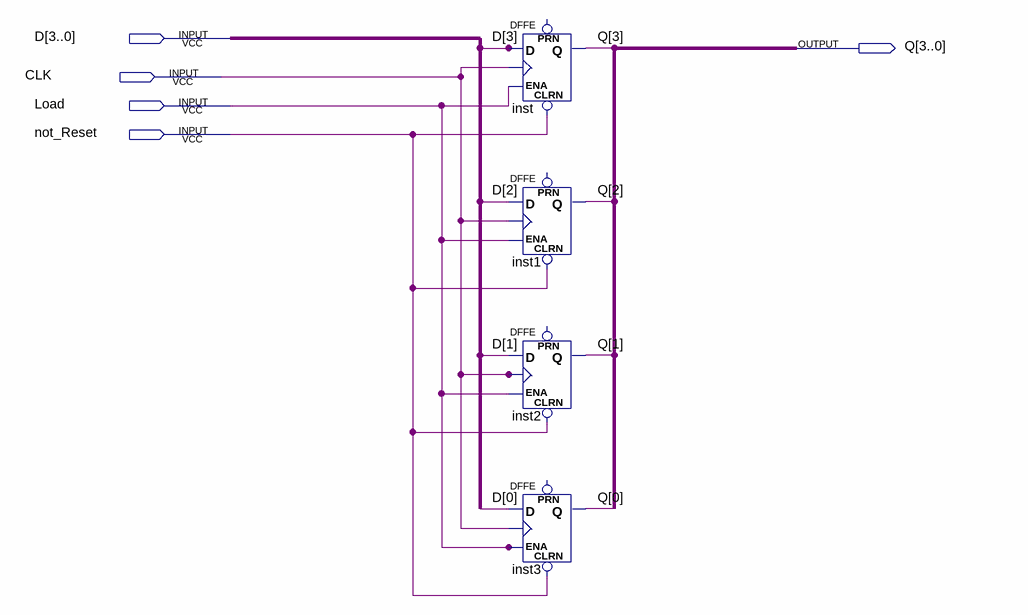
[diagram p0: schematic sheet]
// Quartus schematic reg_4bit.bdf as structural Verilog: 4 symbols, 5 pins
module reg_4bit (
  input  [3:0] D,
  input  CLK,
  input  Load,
  input  not_Reset,
  output [3:0] Q
);

  DFFE inst (.CLRN(not_Reset), .D(D[3]), .CLK(CLK), .ENA(Load), .Q(Q[3]));  // open: PRN
  DFFE inst1 (.CLRN(not_Reset), .D(D[2]), .CLK(CLK), .ENA(Load), .Q(Q[2]));  // open: PRN
  DFFE inst2 (.CLRN(not_Reset), .D(D[1]), .CLK(CLK), .ENA(Load), .Q(Q[1]));  // open: PRN
  DFFE inst3 (.CLRN(not_Reset), .D(D[0]), .CLK(CLK), .ENA(Load), .Q(Q[0]));  // open: PRN
endmodule
